# EAGLE design JDY-40 Rx (EAGLE 9.5.1)
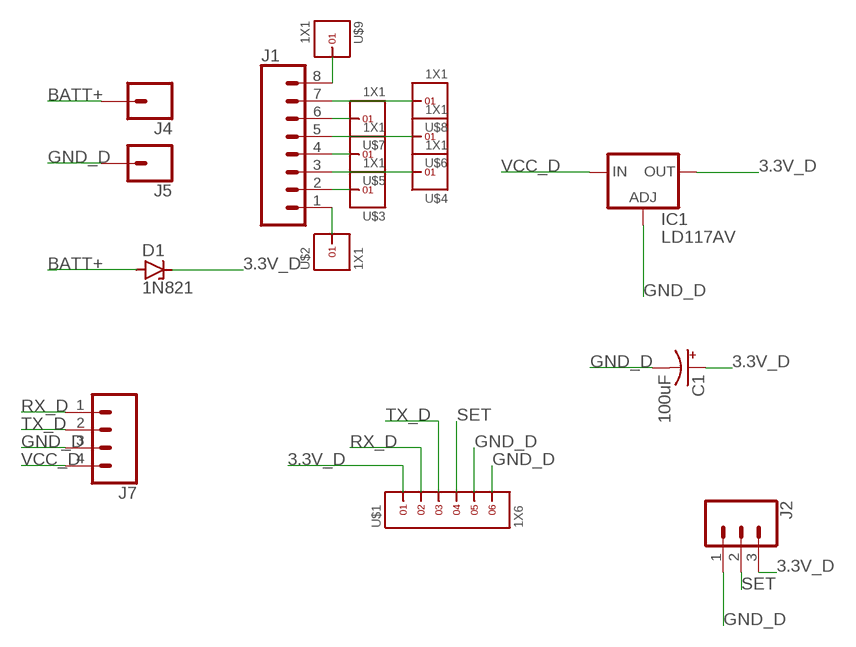
[diagram p0: schematic, sheet 1]

## Parts
C1  100uF  100UF-POLAR-RADIAL-2.5MM-25V-20%  [CPOL-RADIAL-2.5MM-6.5MM]
D1  1N821  [DO35Z10]
IC1  LD117AV  [TO220L1]
J1  CONN_08"  [1X08]
J2  CONN_03  [1X03]
J4  CONN_01  [1X01]
J5  CONN_01  [1X01]
J7  CONN_04  [1X04]
U$1  1X6  [1X6]
U$2  1X1  [1X1]
U$3  1X1  [1X1]
U$4  1X1  [1X1]
U$5  1X1  [1X1]
U$6  1X1  [1X1]
U$7  1X1  [1X1]
U$8  1X1  [1X1]
U$9  1X1  [1X1]

## Nets
3.3V_D: C1.1(+) D1.C IC1.2(OUT) J2.3 U$1.1
BATT+: D1.A J4.1
GND_D: C1.2(-) IC1.1(ADJ) J2.1 J5.1 J7.3 U$1.5 U$1.6
N$1: J1.1 U$2.1
N$2: J1.2 U$3.1
N$3: J1.3 U$4.1
N$4: J1.4 U$5.1
N$5: J1.5 U$6.1
N$6: J1.6 U$7.1
N$7: J1.7 U$8.1
N$8: J1.8 U$9.1
RX_D: J7.1 U$1.2
SET: J2.2 U$1.4
TX_D: J7.2 U$1.3
VCC_D: IC1.3(IN) J7.4

## Library data of the parts
C1 = SparkFun-Capacitors:100UF-POLAR: 100µF polarized capacitors A capacitor is a passive two-terminal electrical component used to store electrical energy temporarily in an electric field.; PROD_ID: CAP-08439
D1 = diode:1N821: Reference DIODE temperature compensated, 6,2 V
IC1 = v-reg:LD117A?*: Low drop fixed and adjustable positive voltage regulators 1 A Source: http://www.st.com/stonline/products/literature/ds/7194/ld1117axx.pdf
J1 = SparkFun-Connectors:CONN_08: Multi connection point. Often used as Generic Header-pin footprint for 0.1 inch spaced/style header connections On any of the 0.1 inch spaced packages, you can populate with these: Break Away Headers - Straight <https://www.sparkfun.com/products/116> (PRT-00116) Break Away Male Headers - Right Angle <https://www.sparkfun.com/products/553> (PRT-00553) Female Headers <https://www.sparkfun.com/products/115> (PRT-00115) Break Away Headers - Machine Pin <https://www.sparkfun.com/products/117> (PRT-00117) Break Away Female Headers - Swiss Machine Pin <https://www.sparkfun.com/products/743> (PRT-00743) Arduino Stackable Header - 8 Pin <https://www.sparkfun.com/products/9279> (PRT-09279) For SCREWTERMINALS and SPRING TERMINALS visit here: Screw Terimnals on SparkFun.com <https://www.sparkfun.com/search/results?term=Screw+Terminals> (5mm/3.5mm/2.54mm spacing) This device is also useful as a general connection point to wire up your design to another part of your project. Our various solder wires solder well into these plated through hole pads. Hook-Up Wire - Assortment (Stranded, 22 AWG) <https://www.sparkfun.com/products/11375> (PRT-11375) Hook-Up Wire - Assortment (Solid Core, 22 AWG) <https://www.sparkfun.com/products/11367> (PRT-11367) View the entire wire category on our website here <https://www.sparkfun.com/categories/141> Special notes: Molex polarized connector foot print use with SKU : PRT-08231 with associated crimp pins and housings. 1MM SMD Version SKU: PRT-10208 NOTES ON THE VARIANTS LOCK and LOCK_LONGPADS... This footprint was designed to help hold the alignment of a through-hole component (i.e. 6-pin header) while soldering it into place. You may notice that each hole has been shifted either up or down by 0.005 of an inch from it's more standard position (which is a perfectly straight line). This slight alteration caused the pins (the squares in the middle) to touch the edges of the holes. Because they are alternating, it causes a "brace" to hold the component in place. 0.005 has proven to be the perfect amount of "off-center" position when using our standard breakaway headers. Although looks a little odd when you look at the bare footprint, once you have a header in there, the alteration is very hard to notice. Also,if you push a header all the way into place, it is covered up entirely on the bottom side.; PROD_ID: CONN-08438
J2 = SparkFun-Connectors:CONN_03: Multi connection point. Often used as Generic Header-pin footprint for 0.1 inch spaced/style header connections On any of the 0.1 inch spaced packages, you can populate with these: Break Away Headers - Straight <https://www.sparkfun.com/products/116> (PRT-00116) Break Away Male Headers - Right Angle <https://www.sparkfun.com/products/553> (PRT-00553) Female Headers <https://www.sparkfun.com/products/115> (PRT-00115) Break Away Headers - Machine Pin <https://www.sparkfun.com/products/117> (PRT-00117) Break Away Female Headers - Swiss Machine Pin <https://www.sparkfun.com/products/743> (PRT-00743) Stackable Header - 3 Pin (Female, 0.1") <https://www.sparkfun.com/products/13875> (PRT-13875) For SCREWTERMINALS and SPRING TERMINALS visit here: Screw Terimnals on SparkFun.com <https://www.sparkfun.com/search/results?term=Screw+Terminals> (5mm/3.5mm/2.54mm spacing) This device is also useful as a general connection point to wire up your design to another part of your project. Our various solder wires solder well into these plated through hole pads. Hook-Up Wire - Assortment (Stranded, 22 AWG) <https://www.sparkfun.com/products/11375> (PRT-11375) Hook-Up Wire - Assortment (Solid Core, 22 AWG) <https://www.sparkfun.com/products/11367> (PRT-11367) View the entire wire category on our website here <https://www.sparkfun.com/categories/141> Special notes: Molex polarized connector foot print use with SKU : PRT-08232 with associated crimp pins and housings.
J4 J5 = SparkFun-Connectors:CONN_01: Single connection point. Often used as Generic Header-pin footprint for 0.1 inch spaced/style header connections On any of the 0.1 inch spaced packages, you can populate with these: Break Away Headers - Straight <https://www.sparkfun.com/products/116> (PRT-00116) Break Away Male Headers - Right Angle <https://www.sparkfun.com/products/553> (PRT-00553) Female Headers <https://www.sparkfun.com/products/115> (PRT-00115) Break Away Headers - Machine Pin <https://www.sparkfun.com/products/117> (PRT-00117) Break Away Female Headers - Swiss Machine Pin <https://www.sparkfun.com/products/743> (PRT-00743) This device is also useful as a general connection point to wire up your design to another part of your project. Our various solder wires solder well into these plated through hole pads. Hook-Up Wire - Assortment (Stranded, 22 AWG) <https://www.sparkfun.com/products/11375> (PRT-11375) Hook-Up Wire - Assortment (Solid Core, 22 AWG) <https://www.sparkfun.com/products/11367> (PRT-11367) View the entire wire category on our website here <https://www.sparkfun.com/categories/141> Special notes: SMTSO-256-ET is a "flush mount" nut for a 4-40 screw. We mostly use this on specialty testbeds; it is a nice way to connect hardware to your PCB at an adjustable hieght. Also note, the SNAP packages are for using a snappable style connector. We sell a baggie of snaps and they are also used on two LilyPad designs: Snap Assortment - 30 pack (male and female) <https://www.sparkfun.com/products/11347> (DEV-11347) LilyPad Arduino SimpleSnap <https://www.sparkfun.com/products/10941> (DEV-10941) LilyPad SimpleSnap Protoboard <https://www.sparkfun.com/products/10940> (DEV-10940)
J7 = SparkFun-Connectors:CONN_04: Multi connection point. Often used as Generic Header-pin footprint for 0.1 inch spaced/style header connections On any of the 0.1 inch spaced packages, you can populate with these: Break Away Headers - Straight <https://www.sparkfun.com/products/116> (PRT-00116) Break Away Male Headers - Right Angle <https://www.sparkfun.com/products/553> (PRT-00553) Female Headers <https://www.sparkfun.com/products/115> (PRT-00115) Break Away Headers - Machine Pin <https://www.sparkfun.com/products/117> (PRT-00117) Break Away Female Headers - Swiss Machine Pin <https://www.sparkfun.com/products/743> (PRT-00743) For SCREWTERMINALS and SPRING TERMINALS visit here: Screw Terimnals on SparkFun.com <https://www.sparkfun.com/search/results?term=Screw+Terminals> (5mm/3.5mm/2.54mm spacing) This device is also useful as a general connection point to wire up your design to another part of your project. Our various solder wires solder well into these plated through hole pads. Hook-Up Wire - Assortment (Stranded, 22 AWG) <https://www.sparkfun.com/products/11375> (PRT-11375) Hook-Up Wire - Assortment (Solid Core, 22 AWG) <https://www.sparkfun.com/products/11367> (PRT-11367) View the entire wire category on our website here <https://www.sparkfun.com/categories/141> Special notes: Molex polarized connector foot print use with SKU : PRT-08231 with associated crimp pins and housings. 1MM SMD Version SKU: PRT-10208; PROD_ID: CONN-09696
U$1 = headers(2mm):1X6
U$2-U$9 = headers(2mm):1X1

## Net classes
0 default: width 0.254 mm, clearance 0.254 mm
1 power: width 0.61 mm, drill 0.711 mm, clearance 0.33 mm
2 gnd: width 0.305 mm, drill 0.711 mm, clearance 0.254 mm
3 usbvcc: width 0.508 mm, drill 0.711 mm, clearance 0.254 mm
4 aref: width 0.406 mm

## Board
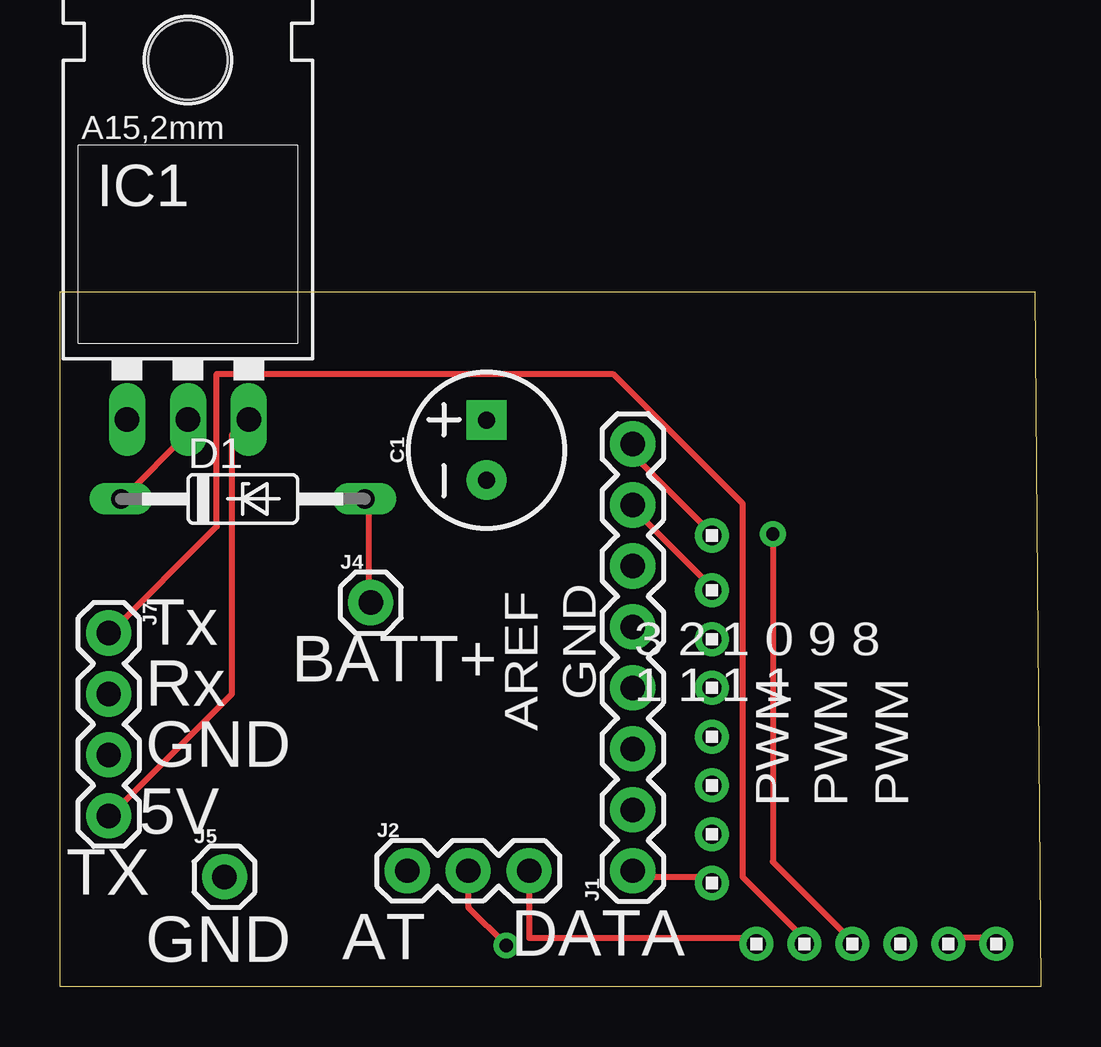
[diagram p1: board, top side]
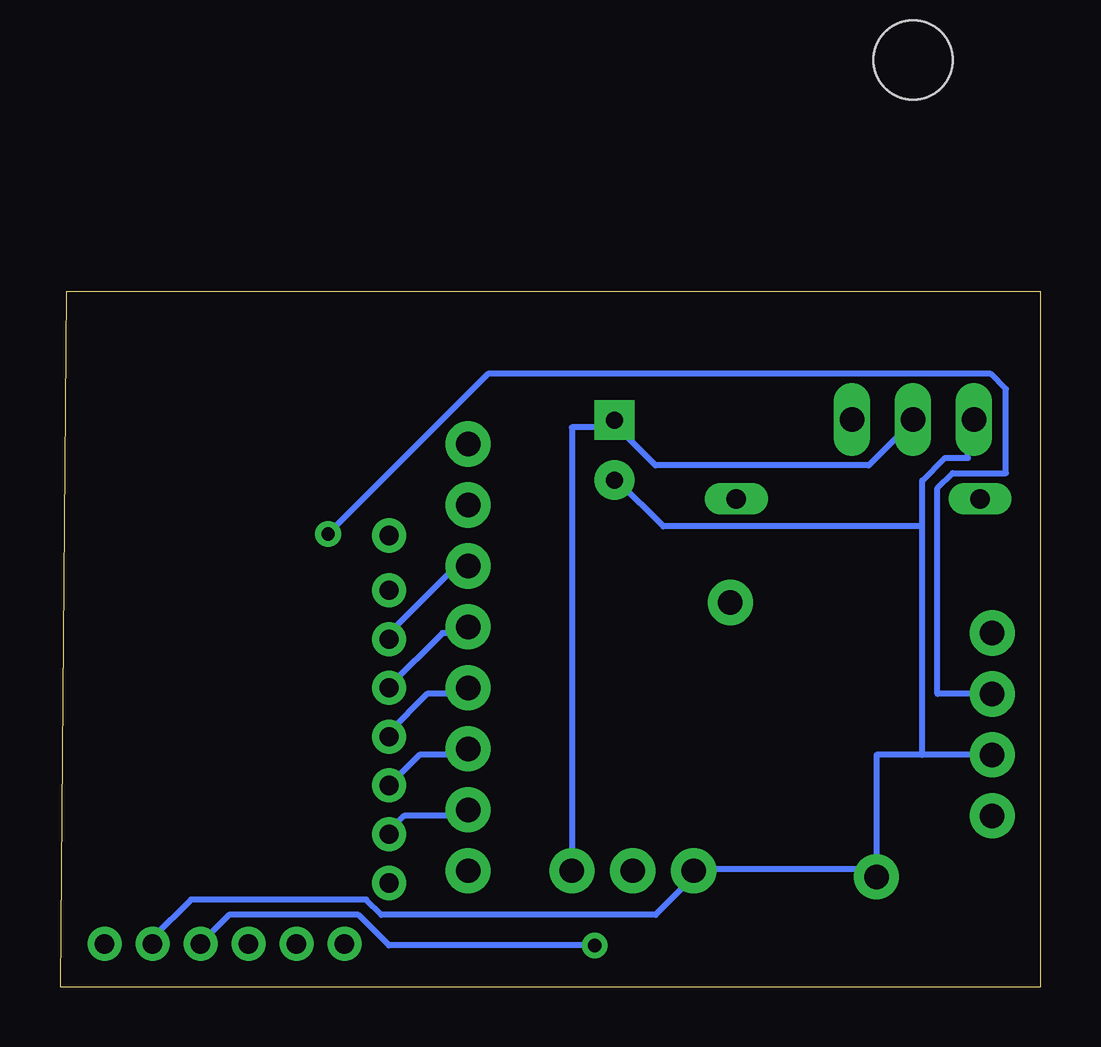
[diagram p2: board, bottom side, seen from below]

Size 40.89 x 28.96 mm. Coordinates in mm from the lower left corner, seen from the top.
Outline: 0,28.96 40.64,28.96 40.89,0 0,0 0,28.96
Copper layers (1*16): Top 0.035mm / dielectric 1.5mm / Bottom 0.035mm
Design rules "default": minimum track width 10mil, minimum drill 22mil, track to track 10mil, track to pad 10mil, pad to pad 10mil, via to via 16mil, smd to smd 8mil, copper to edge 30mil, drill to drill 12mil, minimum pad ring 10mil, minimum via ring 10mil, stop-mask expansion 4mil, vias tented up to drill 0mil, thermal gap 10mil
vRestrict: area 20.8,11.9 to 22.5,15.6; area 28.8,7.5 to 30.4,11; area 31.4,7.5 to 32.9,11; area 33.9,7.5 to 35.4,11; area 38,5.1 to 38.5,5.3

### Footprints (pad centres in the part's own frame; a part is rotated, then mirrored left to right if it is on the bottom)
CPOL-RADIAL-2.5MM-6.5MM = drill 0.7 pad 1.651 square: 1 1.25,0 | drill 0.7 pad 1.651: 2 -1.25,0
DO35Z10 = drill 0.813 long: A 5.08,0; C -5.08,0
TO220L1 = drill 1.016 long: 1 -2.54,-3.81; 2 0,-3.81; 3 2.54,-3.81 | hole 3.302: 0,11.176
1X08 = drill 1.016 pad 1.88: 1 0,0; 2 2.54,0; 3 5.08,0; 4 7.62,0; 5 10.16,0; 6 12.7,0; 7 15.24,0; 8 17.78,0
1X03 = drill 1.016 pad 1.88: 1 0,0; 2 2.54,0; 3 5.08,0
1X01 = drill 1.016 pad 1.88: 1 0,0
1X04 = drill 1.016 pad 1.88: 1 0,0; 2 2.54,0; 3 5.08,0; 4 7.62,0
1X6 = drill 0.8 pad 1.422: 1 -5,0; 2 -3,0; 3 -1,0; 4 1,0; 5 3,0; 6 5,0
1X1 = drill 0.8 pad 1.422: 1 0,0

### Placement (x,y rotation side)
C1  17.78,22.35 90 top
D1  7.62,20.32 0 top
IC1  5.33,27.43 0 top
J1  23.88,4.83 90 top
J2  14.48,4.83 0 top
J4  12.95,16 0 top
J5  6.86,4.57 0 top
J7  2.03,14.73 270 top
U$1  34.04,1.78 0 top
U$2  27.18,4.32 0 top
U$3  27.18,6.35 0 top
U$4  27.18,8.38 0 top
U$5  27.18,10.41 0 top
U$6  27.18,12.45 0 top
U$7  27.18,14.48 0 top
U$8  27.18,16.51 0 top
U$9  27.18,18.8 0 top

### Tracks (layer width: path | path; a pad name or v marks a point on that pad's centre or on a via)
3.3V_D
  Top 0.254: J2.3 19.56,2.03 28.77,2.03 U$1.1 | D1.C 2.73,20.45 5.27,22.99 5.27,23.62 IC1.2
  Bottom 0.254: IC1.2 5.27,23.62 7.18,21.72 16.07,21.72 17.65,23.3 C1.1 17.97,23.3 19.56,23.3 J2.3
BATT+
  Top 0.254: D1.A 12.89,20.13 12.89,16 J4.1
GND_D
  Top 0.254: U$1.5 37.34,2.03 38.93,2.03 U$1.6
  Bottom 0.254: U$1.5 37.02,2.03 35.43,3.62 28.13,3.62 27.5,2.98 16.07,2.98 14.48,4.57 J2.1 14.48,4.89 6.86,4.89 | 4.95,9.65 4.95,19.18 | 4.95,19.18 4.95,21.08 4,22.03 3.05,22.03 3.05,23.62 IC1.1 | J7.3 4.95,9.65 | 4.95,19.18 15.75,19.18 17.65,21.08 C1.2 | 6.86,4.89 6.86,9.65 4.95,9.65 | 6.86,4.89 J5.1
N$1
  Top 0.254: U$2.1 27.18,4.57 24,4.57 J1.1
N$2
  Bottom 0.254: U$3.1 27.18,6.48 26.54,7.11 24,7.11 J1.2
N$3
  Bottom 0.254: U$4.1 25.91,9.65 24,9.65 J1.3
N$4
  Bottom 0.254: U$5.1 27.18,10.61 25.59,12.19 24,12.19 J1.4
N$5
  Bottom 0.254: U$6.1 27.18,12.51 24.96,14.73 24,14.73 J1.5
N$6
  Bottom 0.254: U$7.1 27.18,14.73 24.64,17.27 24,17.27 J1.6
N$7
  Top 0.254: U$8.1 27.18,16.64 24,19.81 J1.7
N$8
  Top 0.254: U$9.1 27.18,18.86 24,22.03 24,22.35 J1.8
RX_D
  Top 0.254: U$1.2 30.99,2.03 28.45,4.57 28.45,20.13 23.05,25.53 6.54,25.53 6.54,19.18 2.1,14.73 J7.1
SET  (via drill 0.56)
  Top 0.254: v18.61,1.71 17.02,3.3 J2.2
  Bottom 0.254: v18.61,1.71 27.18,1.71 28.45,2.98 33.84,2.98 34.8,2.03 U$1.4
TX_D  (via drill 0.56)
  Top 0.254: v29.72,18.86 29.72,5.21 32.89,2.03 U$1.3
  Bottom 0.254: v29.72,18.86 23.05,25.53 2.1,25.53 1.46,24.89 1.46,21.4 3.68,21.4 4.32,20.76 4.32,12.19 J7.2
VCC_D
  Top 0.254: IC1.3 7.81,23.62 7.18,22.99 7.18,12.19 2.1,7.11 J7.4

### Text on the board
tNames: 3 2 1 0 9 8 | GND | 1 1 1 1 | AREF | PWM | PWM | PWM | USB
Reference: C8 | C2 | R11 | C4 | C5
_tsilk: Tx | BATT+ | Rx | GND | 5V | TX | AT | GND | DATA